# Altium schematic sheet Mainboard.SchDoc
size A2
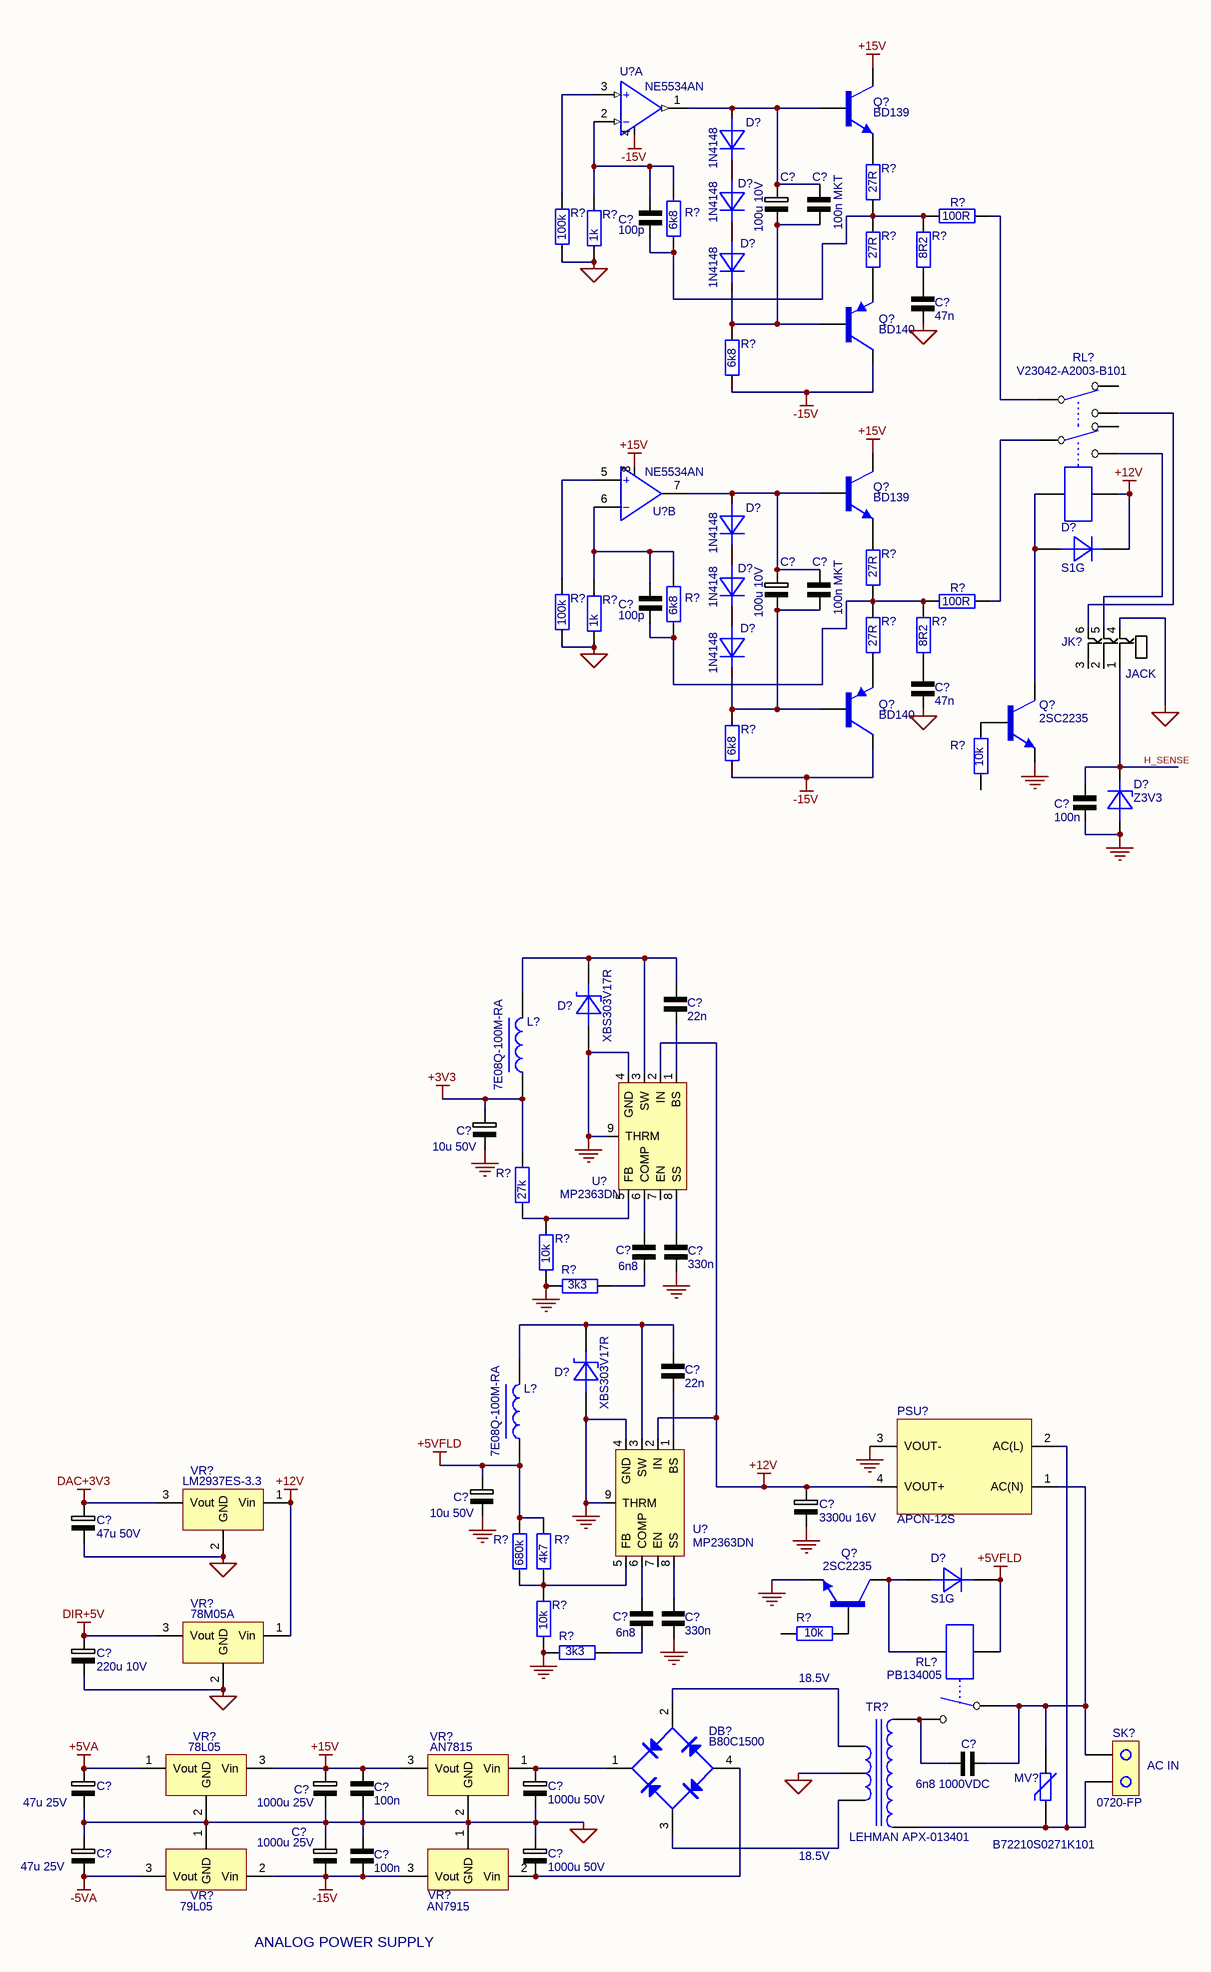
[diagram p0: Mainboard.SchDoc]

## Parts
(Parts that share a designator on the sheet are numbered #1, #2 ... from top to bottom, then left to right.)
C?#1  100u 10V  [CAP PF 5.08/6.5]
C?#2  100n MKT  [CAP POLY 5.08/7.5/2.5]
C?#3  100p  [CAP200]
C?#4  47n  [CAP200]
C?#5  100u 10V  [CAP PF 5.08/6.5]
C?#6  100n MKT  [CAP POLY 5.08/7.5/2.5]
C?#7  100p  [CAP200]
C?#8  47n  [CAP200]
C?#9  100n  [SM 0603]
C?#10  22n  [SM 0603]
C?#11  10u 50V  [CAP RADIAL 2.5/6]
C?#12  6n8  [SM 0603]
C?#13  330n  [SM 0603]
C?#14  22n  [SM 0603]
C?#15  10u 50V  [CAP RADIAL 2.5/6]
C?#16  3300u 16V  [CAP RADIAL 2.5/6]
C?#17  47u 50V  [CAP RADIAL 2.5/6]
C?#18  6n8  [SM 0603]
C?#19  330n  [SM 0603]
C?#20  220u 10V  [CAP RADIAL 2.5/6]
C?#21  6n8 1000VDC  [SM 0603]
C?#22  47u 25V  [CAP RADIAL 2.5/6]
C?#23  1000u 25V  [CAP RADIAL 2.5/6]
C?#24  100n  [SM 0603]
C?#25  1000u 50V  [CAP RADIAL 2.5/6]
C?#26  47u 25V  [CAP RADIAL 2.5/6]
C?#27  1000u 25V  [CAP RADIAL 2.5/6]
C?#28  100n  [SM 0603]
C?#29  1000u 50V  [CAP RADIAL 2.5/6]
D?#1  1N4148  [DIODE SMALL GLASS]
D?#2  1N4148  [DIODE SMALL GLASS]
D?#3  1N4148  [DIODE SMALL GLASS]
D?#4  1N4148  [DIODE SMALL GLASS]
D?#5  1N4148  [DIODE SMALL GLASS]
D?#6  S1G  [SM MELF]
D?#7  1N4148  [DIODE SMALL GLASS]
D?#8  Z3V3  [SM MINIMELF]
D?#9  XBS303V17R  [SM SMC]
D?#10  XBS303V17R  [SM SMC]
D?#11  S1G  [SM MELF]
DB?  B80C1500  [DIODE BRIDGE DFS]
JK?  JACK  [JACK 6-35]
L?#1  7E08Q-100M-RA  [SM 0603]
L?#2  7E08Q-100M-RA  [SM 0603]
MV?  B72210S0271K101  [MOV14MM]
PSU?  APCN-12S  [ARCH_APCN]
Q?#1  BD139  [SOT-32]
Q?#2  BD140  [SOT-32]
Q?#3  BD139  [SOT-32]
Q?#4  BD140  [SOT-32]
Q?#5  2SC2235  [SM SOT-23]
Q?#6  2SC2235  [SM SOT-23]
R?#1  27R  [RES 1/4W H]
R?#2  27R  [RES 1/4W H]
R?#3  100R  [RES 1/4W H]
R?#4  6k8  [RES 1/4W H]
R?#5  100k  [RES 1/4W H]
R?#6  1k  [RES 1/4W H]
R?#7  8R2  [RES 1/4W H]
R?#8  6k8  [RES 1/4W H]
R?#9  27R  [RES 1/4W H]
R?#10  27R  [RES 1/4W H]
R?#11  100R  [RES 1/4W H]
R?#12  6k8  [RES 1/4W H]
R?#13  100k  [RES 1/4W H]
R?#14  1k  [RES 1/4W H]
R?#15  8R2  [RES 1/4W H]
R?#16  6k8  [RES 1/4W H]
R?#17  10k  [SM 0603]
R?#18  27k  [SM 0603]
R?#19  10k  [SM 0603]
R?#20  3k3  [SM 0603]
R?#21  680k  [SM 0603]
R?#22  4k7  [SM 0603]
R?#23  10k  [SM 0603]
R?#24  10k  [SM 0603]
R?#25  3k3  [SM 0603]
RL?#1  V23042-A2003-B101
RL?#2  PB134005  [EMR161A05]
SK?  0720-FP
TR?  LEHMAN APX-013401
U?#1  NE5534AN  [DIP 08]  (part A of 2)
U?#2  NE5534AN  [DIP 08]  (part B of 2)
U?#3  MP2363DN  [SM SO-8NP]
U?#4  MP2363DN  [SM SO-8NP]
VR?#1  LM2937ES-3.3  [TO-220V]
VR?#2  78M05A  [TO-220V]
VR?#3  78L05  [TO92_REGULATOR]
VR?#4  AN7815  [TO-220V]
VR?#5  AN7915  [TO-220V]
VR?#6  79L05  [TO92_REGULATOR]

## Nets
+3V3: C?#11.1 L?#1.1 R?#18.2
+5VA: C?#22.1 VR?#3.1(Vout)
+5VFLD: C?#15.1 D?#11.2(K) L?#2.1 R?#21.2 R?#22.2 RL?#2.2
+12V: C?#16.1 D?#6.2(K) PSU?.4(VOUT+) RL?#1.2 U?#3.2(IN) U?#4.2(IN) VR?#1.1(Vin) VR?#2.1(Vin)
+15V: C?#23.1 C?#24.1 Q?#1.1(C) Q?#3.1(C) U?#2.8(Vdd) VR?#3.3(Vin) VR?#4.3(Vout)
-5VA: C?#26.2 VR?#6.3(Vout)
-15V: C?#27.2 C?#28.2 Q?#2.1(C) Q?#4.1(C) R?#8.1 R?#16.1 U?#1.4(Vss) VR?#5.3(Vout) VR?#6.2(Vin)
DAC+3V3: C?#17.1 VR?#1.3(Vout)
DIR+5V: C?#20.1 VR?#2.3(Vout)
GND: C?#4.2 C?#8.2 C?#9.2 C?#11.2 C?#13.2 C?#15.2 C?#16.2 C?#17.2 C?#19.2 C?#20.2 C?#22.2 C?#23.2 C?#24.2 C?#25.2 C?#26.1 C?#27.1 C?#28.1 C?#29.1 D?#8.1(A) D?#9.1(A) D?#10.1(A) JK?.4 PSU?.3(VOUT-) Q?#5.3(E) Q?#6.3(E) R?#5.1 R?#6.1 R?#13.1 R?#14.1 R?#19.1 R?#20.2 R?#24.1 R?#25.2 TR?.4 U?#3.4(GND) U?#3.9(THRM) U?#4.4(GND) U?#4.9(THRM) VR?#1.2(GND) VR?#2.2(GND) VR?#3.2(GND) VR?#4.2(GND) VR?#5.1(GND) VR?#6.1(GND)
H_SENSE: C?#9.1 D?#8.2(K) JK?.1
NetC?#1_1: C?#1.1 C?#2.1 D?#1.1(A) Q?#1.2(B) U?#1.1(Out)
NetC?#1_2: C?#1.2 C?#2.2 D?#3.2(K) Q?#2.2(B) R?#8.2
NetC?#3_1: C?#3.1 R?#1.1 R?#2.1 R?#3.2 R?#4.1 R?#7.2
NetC?#3_2: C?#3.2 R?#4.2 R?#6.2 U?#1.2(-)
NetC?#4_1: C?#4.1 R?#7.1
NetC?#5_1: C?#5.1 C?#6.1 D?#4.1(A) Q?#3.2(B) U?#2.7(Out)
NetC?#5_2: C?#5.2 C?#6.2 D?#7.2(K) Q?#4.2(B) R?#16.2
NetC?#7_1: C?#7.1 R?#9.1 R?#10.1 R?#11.2 R?#12.1 R?#15.2
NetC?#7_2: C?#7.2 R?#12.2 R?#14.2 U?#2.6(-)
NetC?#8_1: C?#8.1 R?#15.1
NetC?#10_1: C?#10.1 D?#9.2(K) L?#1.2 U?#3.3(SW)
NetC?#10_2: C?#10.2 U?#3.1(BS)
NetC?#12_1: C?#12.1 U?#3.6(COMP)
NetC?#12_2: C?#12.2 R?#20.1
NetC?#13_1: C?#13.1 U?#3.8(SS)
NetC?#14_1: C?#14.1 D?#10.2(K) L?#2.2 U?#4.3(SW)
NetC?#14_2: C?#14.2 U?#4.1(BS)
NetC?#18_1: C?#18.1 U?#4.6(COMP)
NetC?#18_2: C?#18.2 R?#25.1
NetC?#19_1: C?#19.1 U?#4.8(SS)
NetC?#21_1: C?#21.1 RL?#2.4(N/C) TR?.1(PRIMARY)
NetC?#21_2: C?#21.2 MV?.1 PSU?.1(AC(N)) RL?#2.1(COM) SK?.1
NetC?#25_1: C?#25.1 DB?.1(V+) VR?#4.1(Vin)
NetC?#29_2: C?#29.2 DB?.4(V-) VR?#5.2(Vin)
NetD?#1_2: D?#1.2(K) D?#2.1(A)
NetD?#4_2: D?#4.2(K) D?#5.1(A)
NetD?#6_1: D?#6.1(A) Q?#5.1(C) RL?#1.1
NetD?#11_1: D?#11.1(A) Q?#6.1(C) RL?#2.3
NetDB?_2: DB?.2(AC) TR?.3
NetDB?_3: DB?.3(AC) TR?.5
NetJK?_5: JK?.5 RL?#1.4(N/O)
NetJK?_6: JK?.6 RL?#1.7(N/O)
NetMV?_2: MV?.2 PSU?.2(AC(L)) SK?.2 TR?.2(PRIMARY)
NetQ?#1_3: Q?#1.3(E) R?#1.2
NetQ?#2_3: Q?#2.3(E) R?#2.2
NetQ?#3_3: Q?#3.3(E) R?#9.2
NetQ?#4_3: Q?#4.3(E) R?#10.2
NetQ?#5_2: Q?#5.2(B) R?#17.2
NetQ?#6_2: Q?#6.2(B) R?#23.2
NetR?#3_1: R?#3.1 RL?#1.6(COM)
NetR?#5_2: R?#5.2 U?#1.3(+)
NetR?#11_1: R?#11.1 RL?#1.3(COM)
NetR?#13_2: R?#13.2 U?#2.5(+)
NetR?#18_1: R?#18.1 R?#19.2 U?#3.5(FB)
NetR?#21_1: R?#21.1 R?#22.1 R?#24.2 U?#4.5(FB)

Not connected (* = marked no-connect by the designer): D?#2 2(K); D?#3 1(A); D?#5 2(K); D?#7 1(A); JK? 2 3; R?#17 1; R?#23 1; RL?#1 5(N/C) 8(N/C); U?#3 7(EN); U?#4 7(EN)

## Notes on the sheet
- 18.5V
- (near SK?) AC IN
- (near TR?) 18.5V
- ANALOG POWER SUPPLY

## Library data of the parts
C?#1 C?#5 C?#11 C?#15-C?#17 C?#20 C?#22 C?#23 C?#25-C?#27 C?#29 = POL_CAP
C?#2-C?#4 C?#6-C?#10 C?#12-C?#14 C?#18 C?#19 C?#21 C?#24 C?#28 = CAPACITOR
D?#1-D?#7 D?#11 = STD_DIODE
D?#8 = STD_ZENER
D?#9 D?#10 = STD_SCHOTTKY
DB? = BRIDGE: Diode Bridge; SAP Code: *; 1st Manf.: *; 1st Manf. Part #: *; 1st Manf. Package type: *; 1st Vendor: *; 1st Vendor Part #: *; 1st Vendor Leadtime: *; 1st Vendor Standard Cost: *; 2nd Manf.: *; 2nd Manf. Part #: *; 2nd Manf. Package type: *; 2nd Vendor: *; 2nd Vendor Part #: *; 2nd Vendor Leadtime: *; 2nd Vendor Standard Cost: *; *: *
JK? = STEREO JACK 6.35 WITH CONTACT
L?#1 L?#2 = INDUCTOR1
MV? = MOV: SAP Code: *; 1st Manf.: *; 1st Manf. Part #: *; 1st Manf. Package type: *; 1st Vendor: *; 1st Vendor Part #: *; 1st Vendor Leadtime: *; 1st Vendor Standard Cost: *; 2nd Manf.: *; 2nd Manf. Part #: *; 2nd Manf. Package type: *; 2nd Vendor: *; 2nd Vendor Part #: *; 2nd Vendor Leadtime: *; 2nd Vendor Standard Cost: *; *: *
PSU? = ARCH APCN SERIES PSU
Q?#1 Q?#3 Q?#5 Q?#6 = TRANSISTOR_NPN
Q?#2 Q?#4 = TRANSISTOR_PNP
R?#1-R?#25 = RES
RL?#1 = RELAY-DPDT: SAP Code: *; 1st Manf.: *; 1st Manf. Part #: *; 1st Manf. Package type: *; 1st Vendor: *; 1st Vendor Part #: *; 1st Vendor Leadtime: *; 1st Vendor Standard Cost: *; 2nd Manf.: *; 2nd Manf. Part #: *; 2nd Manf. Package type: *; 2nd Vendor: *; 2nd Vendor Part #: *; 2nd Vendor Leadtime: *; 2nd Vendor Standard Cost: *; *: *
RL?#2 = RELAY-SPST
SK? = AC CONNECTOR
TR? = TRANSFORMER-CT
U?#1 U?#2 = 358: LM358 Dual Operational Amplifier; SAP Code: *; 1st Manf.: *; 1st Manf. Part #: *; 1st Manf. Package type: *; 1st Vendor: *; 1st Vendor Part #: *; 1st Vendor Leadtime: *; 1st Vendor Standard Cost: *; 2nd Manf.: *; 2nd Manf. Part #: *; 2nd Manf. Package type: *; 2nd Vendor: *; 2nd Vendor Part #: *; 2nd Vendor Leadtime: *; 2nd Vendor Standard Cost: *; *: *
VR?#1 VR?#2 VR?#4 = REG 78XX: Fixed voltage regulator; SAP Code: *; 1st Manf.: *; 1st Manf. Part #: *; 1st Manf. Package type: *; 1st Vendor: *; 1st Vendor Part #: *; 1st Vendor Leadtime: *; 1st Vendor Standard Cost: *; 2nd Manf.: *; 2nd Manf. Part #: *; 2nd Manf. Package type: *; 2nd Vendor: *; 2nd Vendor Part #: *; 2nd Vendor Leadtime: *; 2nd Vendor Standard Cost: *; *: *
VR?#3 = REG 78LXX: Low power fixed voltage regulator; SAP Code: *; 1st Manf.: *; 1st Manf. Part #: *; 1st Manf. Package type: *; 1st Vendor: *; 1st Vendor Part #: *; 1st Vendor Leadtime: *; 1st Vendor Standard Cost: *; 2nd Manf.: *; 2nd Manf. Part #: *; 2nd Manf. Package type: *; 2nd Vendor: *; 2nd Vendor Part #: *; 2nd Vendor Leadtime: *; 2nd Vendor Standard Cost: *; *: *
VR?#5 = REG 79xx
VR?#6 = REG_79LXX